# EAGLE design IOIO Sensors Homemade (EAGLE 5.11)
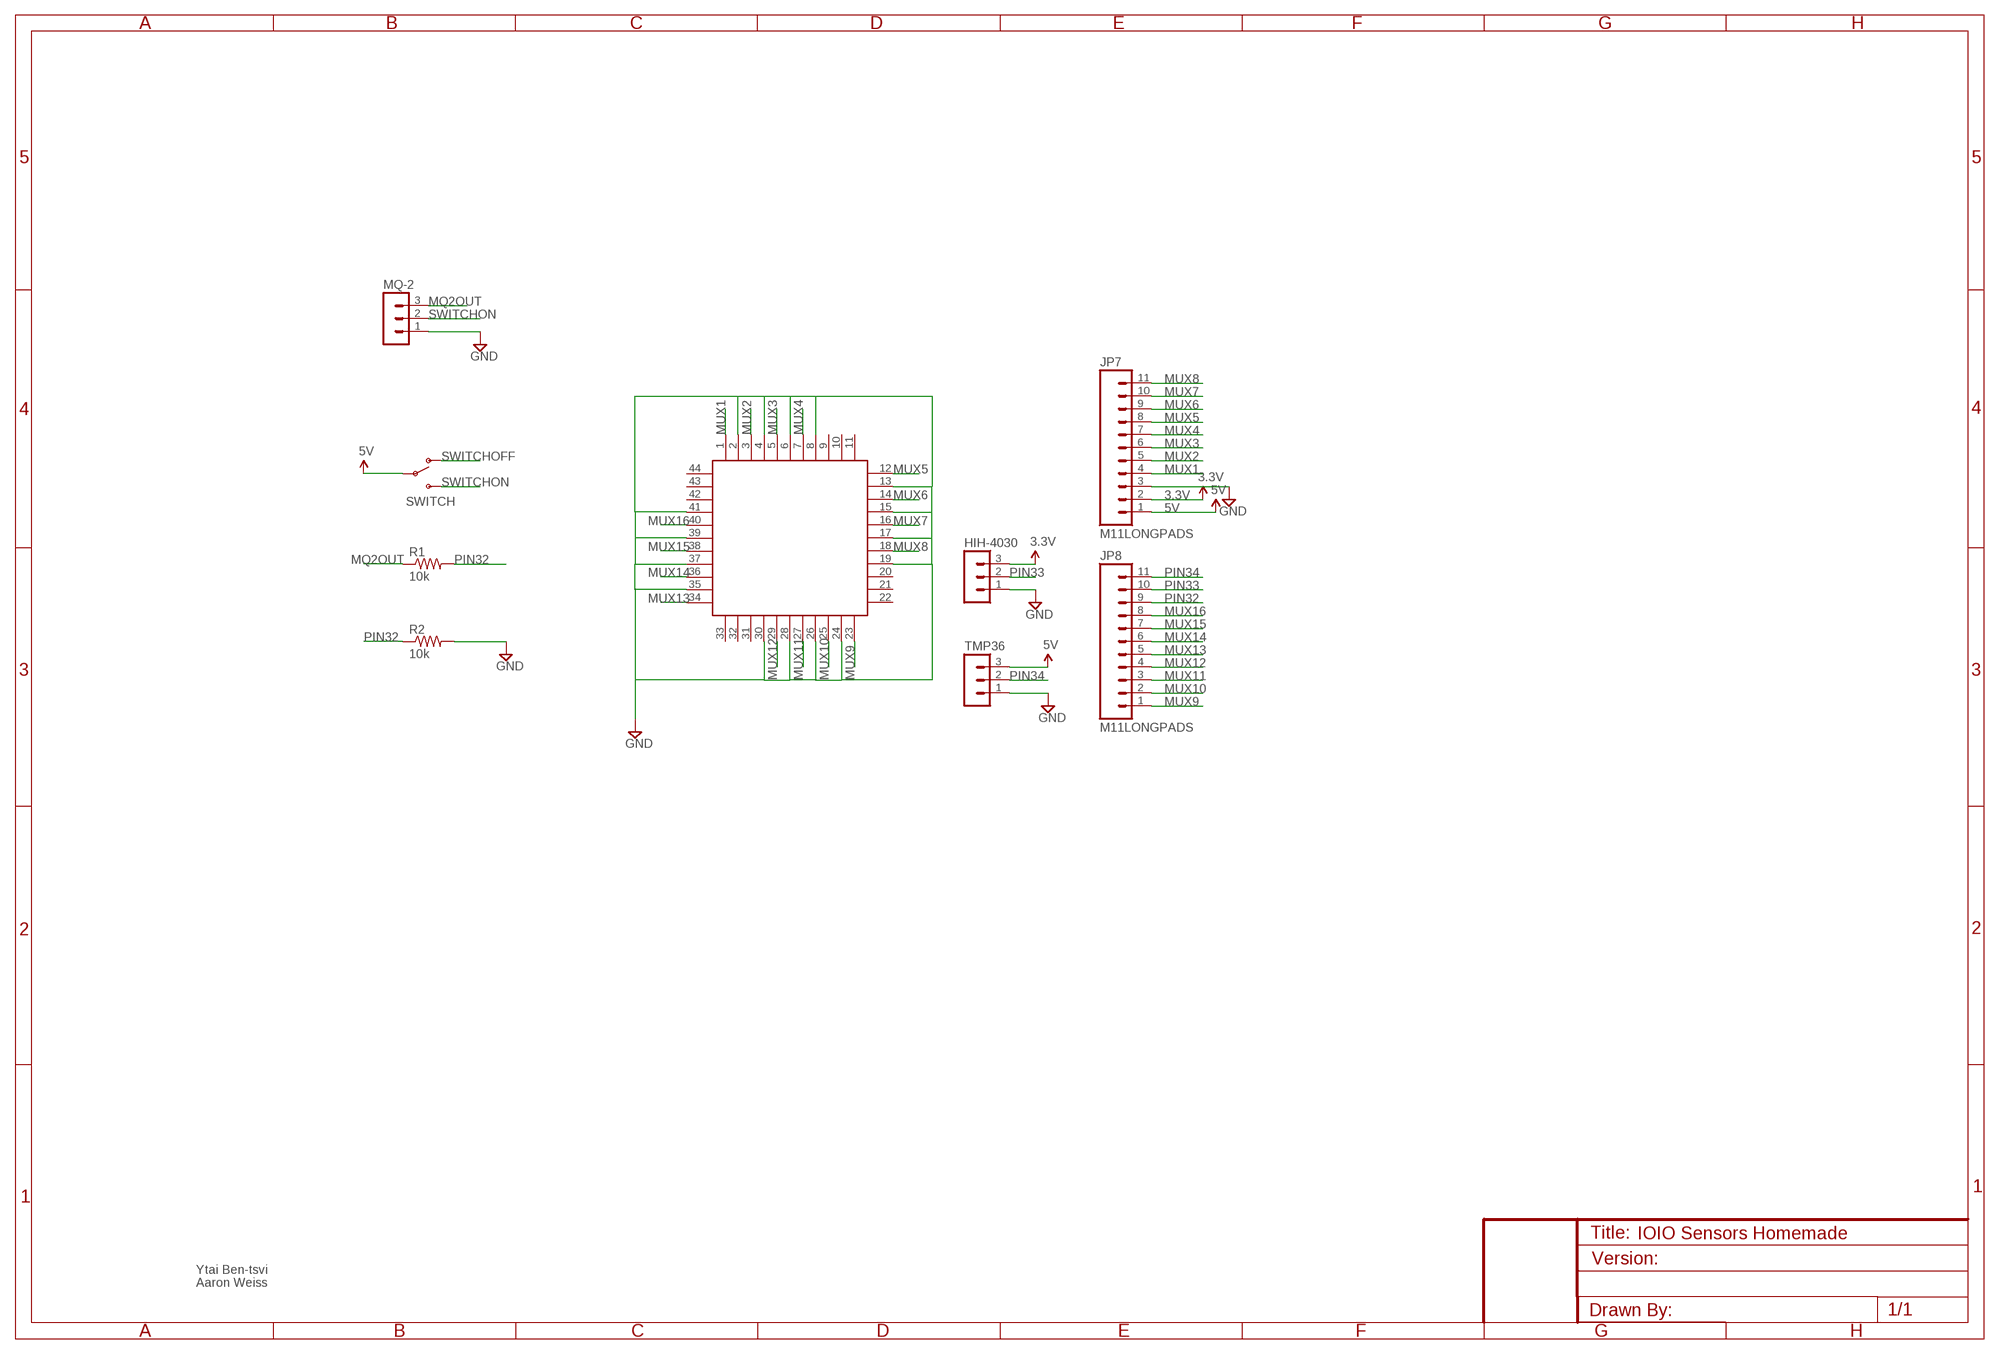
[diagram p0: schematic, sheet 1]

## Parts
HIH-4030  MA03-1  [MA03-1]
JP7  M11LONGPADS  [1X11_LONGPADS]
JP8  M11LONGPADS  [1X11_LONGPADS]
MQ-2  MA03-1  [MA03-1]
R1  10k  R-US_0207/7  [0207/7]
R2  10k  R-US_0207/7  [0207/7]
SWITCH  SWITCH-SPSTPTH_LOCK  [SWITCH-SPDT_LOCK.007S]
TMP36  MA03-1  [MA03-1]
U$4  S44  [S44]

## Nets
3.3V: HIH-4030.3 JP7.2
5V: JP7.1 SWITCH.2(P) TMP36.3
GND: HIH-4030.1 JP7.3 MQ-2.1 R2.2 TMP36.1 U$4.2 U$4.4 U$4.6 U$4.8 U$4.13 U$4.15 U$4.17 U$4.19 U$4.24 U$4.26 U$4.28 U$4.30 U$4.35 U$4.37 U$4.39 U$4.41
MQ2OUT: MQ-2.3 R1.1
MUX1: JP7.4 U$4.1
MUX2: JP7.5 U$4.3
MUX3: JP7.6 U$4.5
MUX4: JP7.7 U$4.7
MUX5: JP7.8 U$4.12
MUX6: JP7.9 U$4.14
MUX7: JP7.10 U$4.16
MUX8: JP7.11 U$4.18
MUX9: JP8.1 U$4.23
MUX10: JP8.2 U$4.25
MUX11: JP8.3 U$4.27
MUX12: JP8.4 U$4.29
MUX13: JP8.5 U$4.34
MUX14: JP8.6 U$4.36
MUX15: JP8.7 U$4.38
MUX16: JP8.8 U$4.40
PIN32: JP8.9 R1.2 R2.1
PIN33: HIH-4030.2 JP8.10
PIN34: JP8.11 TMP36.2
SWITCHOFF: SWITCH.1(O)
SWITCHON: MQ-2.2 SWITCH.3(S)
Unconnected: U$4.9 U$4.10 U$4.11 U$4.20 U$4.21 U$4.22 U$4.31 U$4.32 U$4.33 U$4.42 U$4.43 U$4.44

## Notes on the sheet
- Ytai Ben-tsvi
- Aaron Weiss

## Library data of the parts
HIH-4030 MQ-2 TMP36 = con-lstb:MA03-1: PIN HEADER; OC_FARNELL: unknown; OC_NEWARK: unknown
JP7 JP8 = SparkFun:M11: Header 11 Standard 11-pin 0.1" header. Use with straight break away headers (SKU : PRT-00116), right angle break away headers (PRT-00553), swiss pins (PRT-00743), machine pins (PRT-00117), and female headers (PRT-00115).
R1 R2 = resistor:R-US_: RESISTOR, American symbol
SWITCH = SparkFun:SWITCH-SPST: SPST Switch Simple slide switch. Spark Fun Electronics SKU : COM-00102
U$4 = plcc-socket:S44: 44-pin PLCC through-hole socket

## Board
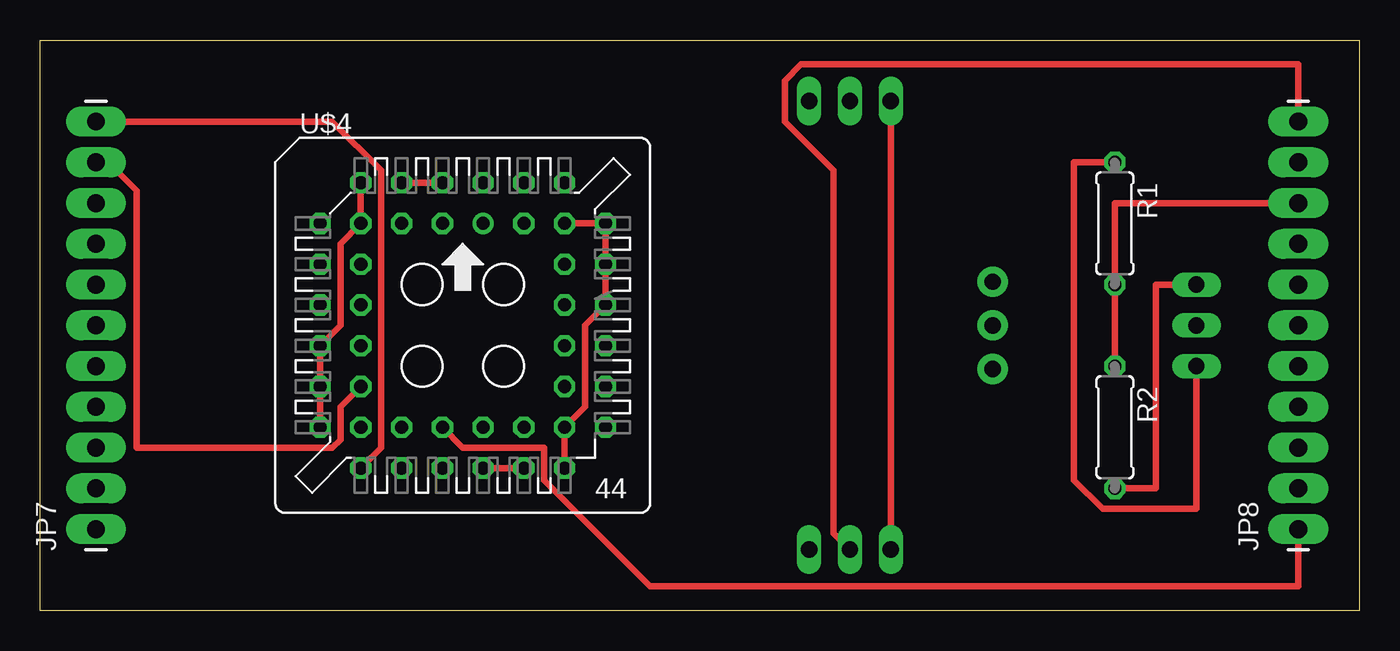
[diagram p1: board, top side]
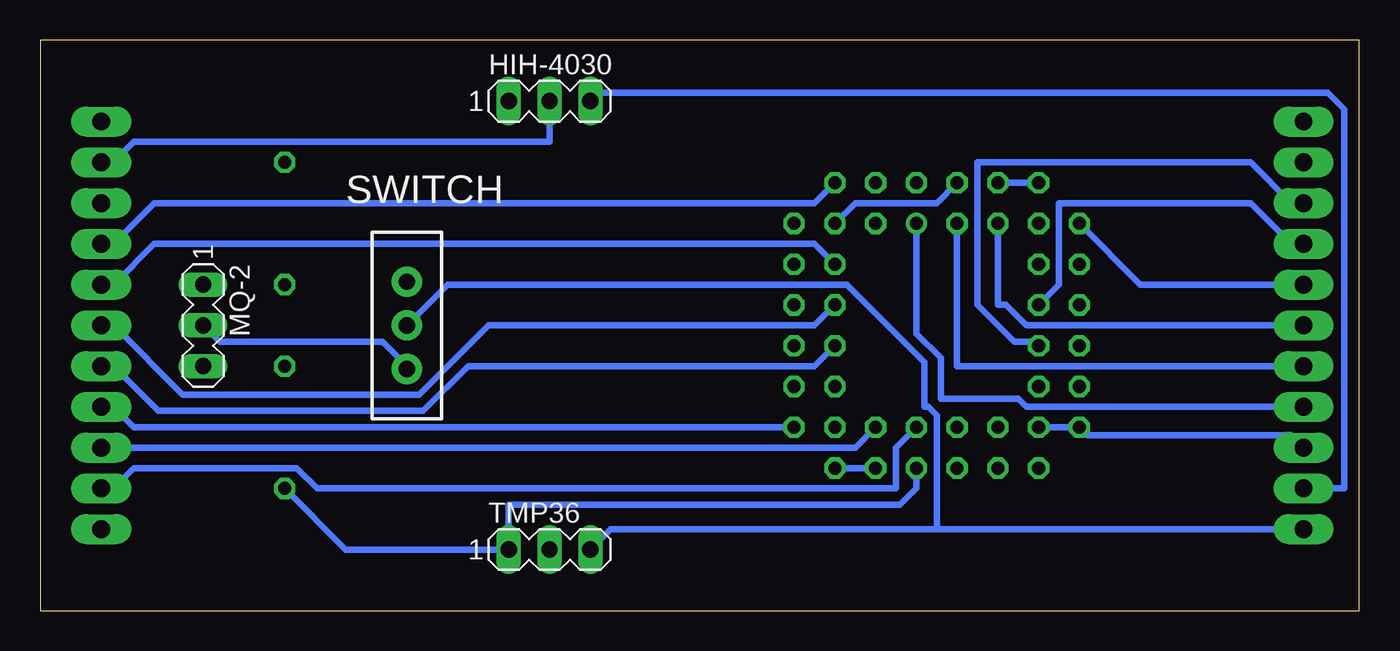
[diagram p2: board, bottom side, seen from below]

Size 82.22 x 35.55 mm. Coordinates in mm from the lower left corner, seen from the top.
Outline: 82.22,0 0,0 0,35.55 82.22,35.55 82.22,0
Copper layers (1*16): Top 0.035mm / dielectric 1.5mm / Bottom 0.035mm
Design rules "default *": minimum track width 16mil, minimum drill 24mil, track to track 16mil, track to pad 16mil, pad to pad 16mil, via to via 16mil, smd to smd 8mil, copper to edge 40mil, drill to drill 8mil, minimum pad ring 10mil, minimum via ring 8mil, stop-mask expansion 4mil, vias tented up to drill 0mil, thermal gap 10mil

### Footprints (pad centres in the part's own frame; a part is rotated, then mirrored left to right if it is on the bottom)
MA03-1 = drill 1.016 long: 1 -2.54,0; 2 0,0; 3 2.54,0
1X11_LONGPADS = drill 1.118 pad 1.88 long: 1 0,0; 2 2.54,0; 3 5.08,0; 4 7.62,0; 5 10.16,0; 6 12.7,0; 7 15.24,0; 8 17.78,0; 9 20.32,0; 10 22.86,0; 11 25.4,0
0207/7 = drill 0.813 octagon: 1 -3.81,0; 2 3.81,0
SWITCH-SPDT_LOCK.007S = drill 1.016 pad 1.88 round: 1 0,2.718; 2 0,0; 3 0,-2.718
S44 = drill 0.813 round: 1 1.27,6.35 | drill 0.813 octagon: 2 -1.27,8.89; 3 -1.27,6.35; 4 -3.81,8.89; 5 -3.81,6.35; 6 -6.35,8.89; 7 -8.89,6.35; 8 -6.35,6.35; 9 -8.89,3.81; 10 -6.35,3.81; 11 -8.89,1.27; 12 -6.35,1.27; 13 -8.89,-1.27; 14 -6.35,-1.27; 15 -8.89,-3.81; 16 -6.35,-3.81; 17 -8.89,-6.35; 18 -6.35,-8.89; 19 -6.35,-6.35; 20 -3.81,-8.89; 21 -3.81,-6.35; 22 -1.27,-8.89; 23 -1.27,-6.35; 24 1.27,-8.89; 25 1.27,-6.35; 26 3.81,-8.89; 27 3.81,-6.35; 28 6.35,-8.89; 29 8.89,-6.35; 30 6.35,-6.35; 31 8.89,-3.81; 32 6.35,-3.81; 33 8.89,-1.27; 34 6.35,-1.27; 35 8.89,1.27; 36 6.35,1.27; 37 8.89,3.81; 38 6.35,3.81; 39 8.89,6.35; 40 6.35,8.89; 41 6.35,6.35; 42 3.81,8.89; 43 3.81,6.35; 44 1.27,8.89

### Placement (x,y rotation side)
HIH-4030  50.47,31.75 0 bottom
JP7  3.48,5.08 90 top
JP8  78.41,5.08 90 top
MQ-2  72.06,17.78 270 bottom
R1  66.98,24.13 270 top
R2  66.98,11.43 270 top
SWITCH  59.36,17.78 0 bottom
TMP36  50.47,3.81 0 bottom
U$4  26.34,17.78 0 top

### Tracks (layer width: path | path; a pad name or v marks a point on that pad's centre or on a via)
3.3V
  Bottom 0.406: HIH-4030.3 47.42,32.26 1.96,32.26 0.94,31.24 0.94,7.62 JP7.2
5V
  Bottom 0.406: TMP36.3 46.66,5.08 26.34,5.08 | JP7.1 26.34,5.08 | SWITCH.2 56.82,20.32 31.93,20.32 27.1,15.49 27.1,12.7 26.85,12.7 26.34,12.19 26.34,5.08
GND
  Top 0.406: TMP36.1 HIH-4030.1 | R2.2 69.52,7.62 69.52,20.32 MQ-2.1 | U$4.17 U$4.15 U$4.13 18.72,17.78 18.72,22.86 U$4.8 U$4.6 | U$4.26 U$4.24 | U$4.28 U$4.30 33.96,12.7 33.96,17.78 U$4.35 U$4.37 U$4.39 U$4.41 | U$4.4 U$4.2
  Bottom 0.406: R2.2 63.17,3.81 TMP36.1 53.01,6.6 28.63,6.6 27.61,7.62 U$4.24 | U$4.19 U$4.17 16.94,10.92 4.24,10.92 JP7.3 | U$4.28 U$4.26 | U$4.6 U$4.4 | U$4.2 26.34,25.4 31.42,25.4 U$4.41
MQ2OUT
  Top 0.406: R1.1 64.44,27.94 64.44,8.13 66.22,6.35 72.06,6.35 MQ-2.3
MUX1
  Bottom 0.406: U$4.1 27.61,17.27 26.09,15.75 26.09,13.21 21.26,13.21 20.75,12.7 JP7.4
MUX2
  Bottom 0.406: U$4.3 25.07,15.24 JP7.5
MUX3
  Bottom 0.406: U$4.5 22.53,19.05 22.02,19.05 20.75,17.78 JP7.6
MUX4
  Bottom 0.406: U$4.7 13.64,20.32 JP7.7
MUX5
  Bottom 0.406: U$4.12 18.72,20.32 18.72,25.4 6.78,25.4 4.24,22.86 JP7.8
MUX6
  Bottom 0.406: U$4.14 20.24,16.76 21.51,16.76 23.8,19.05 23.8,27.94 6.78,27.94 4.24,25.4 JP7.9
MUX7
  Top 0.406: U$4.16 18.72,12.7 18.72,10.67 18.21,10.16 6.02,10.16 6.02,26.16 4.24,27.94 JP7.10
MUX8
  Top 0.406: U$4.18 21.26,10.16 21.26,27.43 18.21,30.48 JP7.11
MUX9
  Top 0.406: U$4.23 26.34,10.16 31.42,10.16 31.42,8.13 38.02,1.52 78.41,1.52 JP8.1
MUX10
  Bottom 0.406: U$4.25 28.88,10.16 28.88,7.62 64.95,7.62 66.22,8.89 76.38,8.89 77.65,7.62 JP8.2
MUX11
  Bottom 0.406: U$4.27 31.42,10.16 JP8.3
MUX12
  Bottom 0.406: U$4.29 76.38,11.43 77.65,12.7 JP8.4
MUX13
  Bottom 0.406: U$4.34 33.96,15.24 55.55,15.24 58.34,12.45 74.85,12.45 77.65,15.24 JP8.5
MUX14
  Bottom 0.406: U$4.36 33.96,17.78 54.28,17.78 58.6,13.46 73.33,13.46 77.65,17.78 JP8.6
MUX15
  Bottom 0.406: U$4.38 33.96,22.86 75.11,22.86 77.65,20.32 JP8.7
MUX16
  Bottom 0.406: U$4.40 33.96,25.4 75.11,25.4 77.65,22.86 JP8.8
PIN32
  Top 0.406: R2.1 R1.2 66.98,25.4 JP8.9
PIN33
  Bottom 0.406: HIH-4030.2 50.47,29.21 76.38,29.21 77.65,27.94 JP8.10
PIN34
  Top 0.406: TMP36.2 49.45,4.83 49.45,27.43 46.41,30.48 46.41,33.02 47.42,34.04 78.41,34.04 JP8.11
SWITCHON
  Bottom 0.406: MQ-2.2 71.04,16.76 60.88,16.76 59.36,15.24 SWITCH.3